# EAGLE design hacklace (EAGLE 6.5.0)
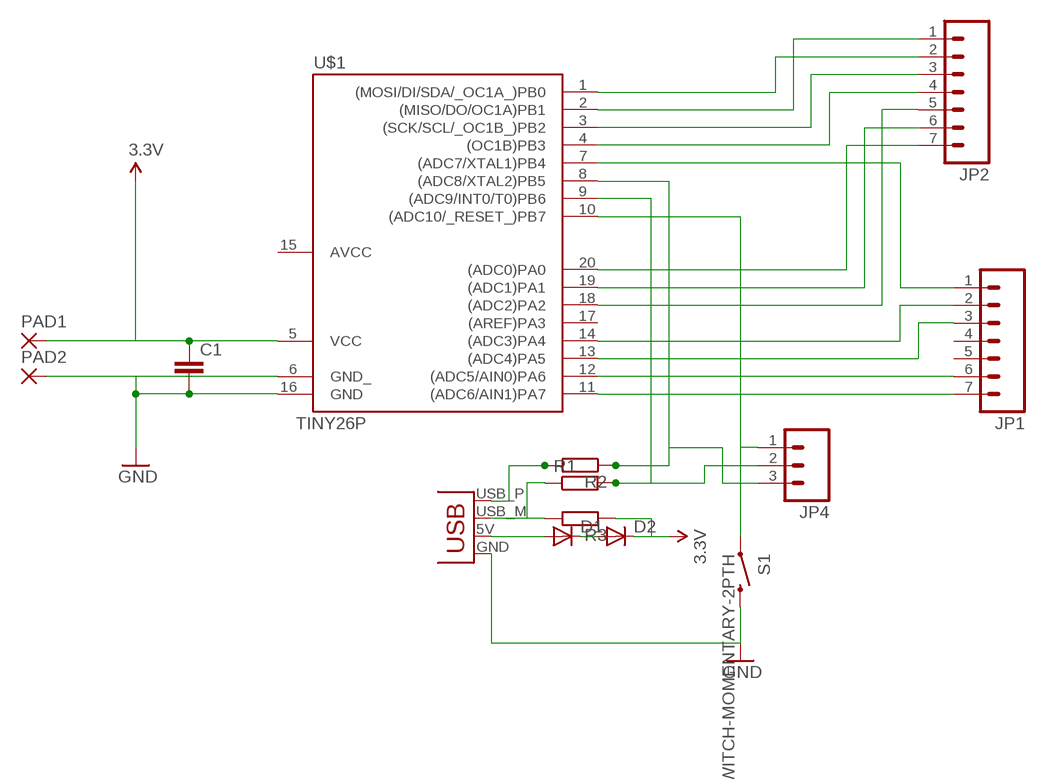
[diagram p0: schematic, sheet 1]

## Parts
C1  C-EU025-025X050  [C025-025X050]
D1  DIODE-D-5  [D-5]
D2  DIODE-D-5  [D-5]
JP1  M07  [1X07]
JP2  M07  [1X07]
JP3  USBPCB  [USB-A-PCB]
JP4  M03PTH  [1X03]
PAD1  1,6/0,8  [1,6/0,8]
PAD2  1,6/0,8  [1,6/0,8]
R1  R-EU_0204/7  [0204/7]
R2  R-EU_0204/7  [0204/7]
R3  R-EU_0204/7  [0204/7]
S1  SWITCH-MOMENTARY-2PTH  [TACTILE-PTH]
U$1  TINY26P  [DIL20]

## Nets
3.3V: C1.1 D2.C PAD1.1(P) R3.1 U$1.5(VCC)
GND: C1.2 JP3.GND PAD2.1(P) S1.3 U$1.6(GND_) U$1.16(GND)
N$1: JP3.USB_M(D-) R1.1 R3.2
N$2: JP4.1 S1.1 U$1.10((ADC10/_RESET_)PB7)
N$3: JP1.2 U$1.14((ADC3)PA4)
N$4: JP4.2 R1.2 U$1.9((ADC9/INT0/T0)PB6)
N$5: JP4.3 R2.1 U$1.8((ADC8/XTAL2)PB5)
N$6: JP2.6 U$1.19((ADC1)PA1)
N$7: JP2.2 U$1.1((MOSI/DI/SDA/_OC1A_)PB0)
N$9: D1.A JP3.5V(VBUS)
N$10: JP2.4 U$1.4((OC1B)PB3)
N$11: JP2.3 U$1.3((SCK/SCL/_OC1B_)PB2)
N$12: JP2.7 U$1.20((ADC0)PA0)
N$13: JP1.6 U$1.12((ADC5/AIN0)PA6)
N$14: JP2.5 U$1.18((ADC2)PA2)
N$15: JP2.1 U$1.2((MISO/DO/OC1A)PB1)
N$16: JP1.3 U$1.13((ADC4)PA5)
N$17: JP1.7 U$1.11((ADC6/AIN1)PA7)
N$18: JP3.USB_P(D+) R2.2
N$19: JP1.1 U$1.7((ADC7/XTAL1)PB4)
N$20: D1.C D2.A
Unconnected: JP1.4 JP1.5 U$1.17((AREF)PA3)

## Power pins joined to a net without a drawn wire
AVCC: U$1.15(AVCC)

## Library data of the parts
C1 = rcl:C-EU: CAPACITOR, European symbol
D1 D2 = diode:DIODE-: DIODE
JP1 JP2 = SparkFun-Connectors:M07: Header 7 Standard 7-pin 0.1" header. Use with straight break away headers (SKU : PRT-00116), right angle break away headers (PRT-00553), swiss pins (PRT-00743), machine pins (PRT-00117), and female headers (PRT-00115). NOTES ON THE VARIANTS LOCK and LOCK_LONGPADS... This footprint was designed to help hold the alignment of a through-hole component (i.e. 7-pin header) while soldering it into place. You may notice that each hole has been shifted either up or down by 0.005 of an inch from it's more standard position (which is usually a perfectly straight line). This slight alteration caused the pins (the squares in the middle) to touch the edges of the holes. Because they are alternating, it causes a "brace" to hold the header in place. 0.005 has proven to be the perfect amount of "off-center" position when using our standard breakaway headers. Although looks a little odd when you look at the bare footprint, once you have a header in there, the alteration is very hard to notice. Also, if you push a header all the way into place, it is covered up entirely on the bottom side. This idea of altering the position of holes to aid alignment will be further integrated into the Sparkfun Library for other footprints. It can help hold any component with 3 or more connection pins.
JP3 = SparkFun-Connectors:USB: USB Connectors USB-B-PTH is fully proven SKU : PRT-00139/CONN-08278 USB-miniB is fully proven SKU : PRT-00587 USB-A-PCB is untested. USB-A-H is throughly reviewed, but untested. Spark Fun Electronics SKU : PRT-00437 USB-B-SMT is throughly reviewed, but untested. Needs silkscreen touching up. USB-A-S has not been used/tested USB-MB-H has not been used/tested USB-MICROB has been used. CONN-09505
JP4 = SparkFun-Connectors:M03: Header 3 Standard 3-pin 0.1" header. Use with straight break away headers (SKU : PRT-00116), right angle break away headers (PRT-00553), swiss pins (PRT-00743), machine pins (PRT-00117), and female headers (PRT-00115). Molex polarized connector foot print use with SKU : PRT-08232 with associated crimp pins and housings.
PAD1 PAD2 = wirepad:1,6/0,8: THROUGH-HOLE PAD
R1-R3 = resistor:R-EU_: RESISTOR, European symbol
S1 = SparkFun-Electromechanical:SWITCH-MOMENTARY-2: Various NO switches- pushbuttons, reed, etc
U$1 = avr-5:TINY26

## Board
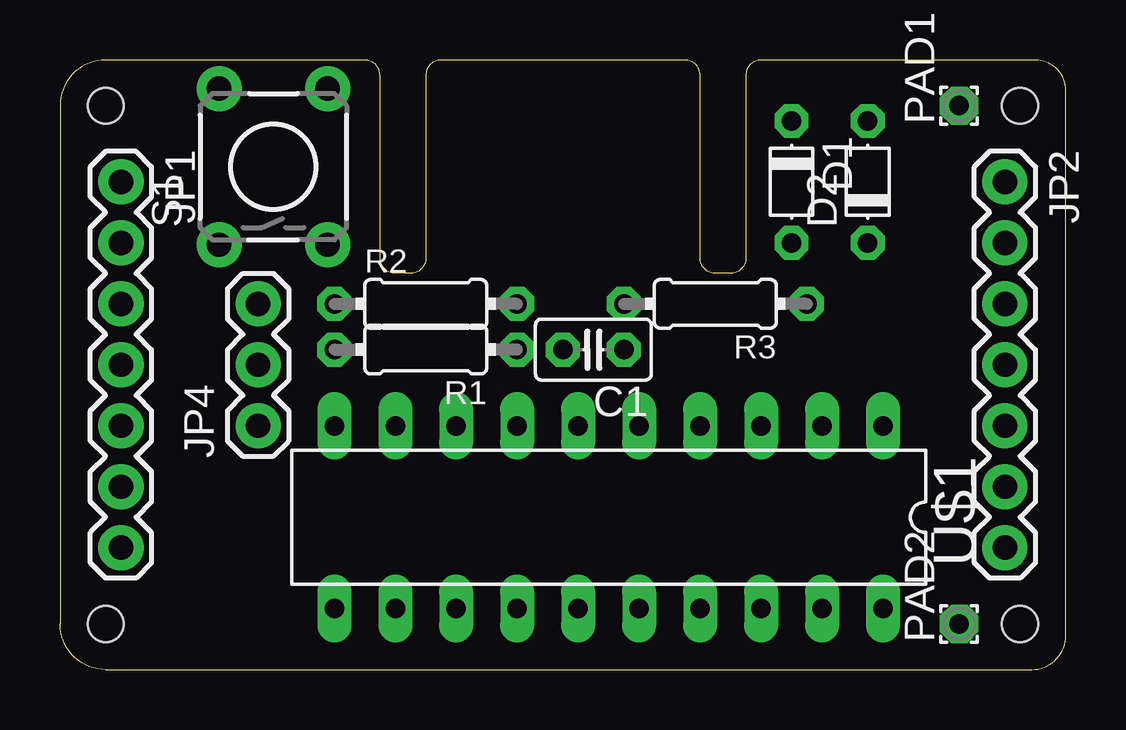
[diagram p1: board, top side]
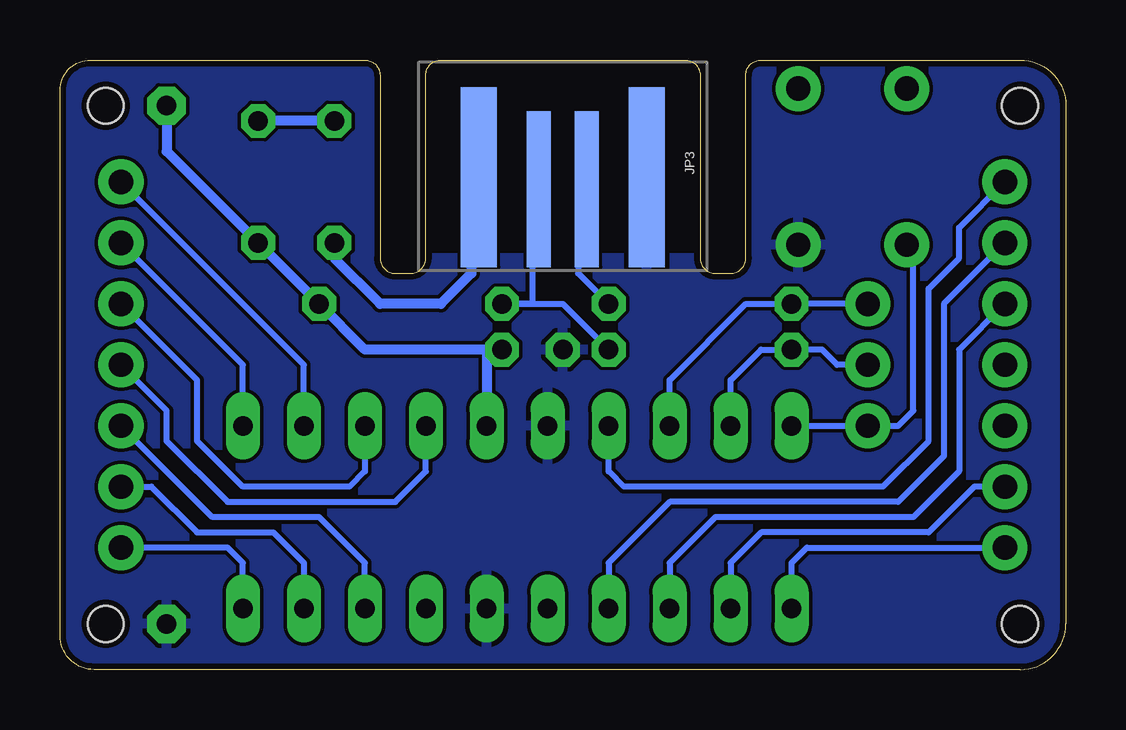
[diagram p2: board, bottom side, seen from below]

Size 41.91 x 25.4 mm. Coordinates in mm from the lower left corner, seen from the top.
Outline: 36.83,25.4 40.64,25.4 arc-90 41.91,24.13 41.91,1.42 arc-90 40.49,0 1.91,0 arc-90 0,1.91 0,23.5 arc-90 1.91,25.4 12.7,25.4 arc-90 13.34,24.77 13.34,17.14 arc90 13.97,16.51 14.61,16.51 arc90 15.24,17.14 15.24,24.77 arc-90 15.88,25.4 26.04,25.4 arc-90 26.67,24.77 26.67,17.14 arc90 27.3,16.51 27.94,16.51 arc90 28.57,17.14 28.57,24.77 arc-90 29.21,25.4 36.82,25.4
Copper layers 16: Bottom 0.035mm
Design rules "eC_1Layer_PClass6_BaseCopperO35_eCDefault": minimum track width 0.15mm, minimum drill 0.35mm, track to track 0.15mm, track to pad 0.15mm, pad to pad 0.15mm, via to via 0.15mm, smd to smd 0mil, copper to edge 0.25mm, drill to drill 0.35mm, minimum pad ring 0.3mm, minimum via ring 0.3mm, stop-mask expansion 0mil, vias tented up to drill 0.45mm, thermal gap 0.2mm
Holes 1.5 mm at 40.01,1.91 40.01,23.5 1.91,1.91 1.91,23.5

### Footprints (pad centres in the part's own frame; a part is rotated, then mirrored left to right if it is on the bottom)
C025-025X050 = drill 0.813 octagon: 1 -1.27,0; 2 1.27,0
D-5 = drill 0.813 octagon: A 2.54,0; C -2.54,0
1X07 = drill 1.016 pad 1.88: 1 0,0; 2 2.54,0; 3 5.08,0; 4 7.62,0; 5 10.16,0; 6 12.7,0; 7 15.24,0
USB-A-PCB = smd 7.5 x 1.5: 5V -0.2,-3.5; GND -0.2,3.5 | smd 6.5 x 1: USB_M 0.3,-1; USB_P 0.3,1
1X03 = drill 1.016 pad 1.88: 1 0,0; 2 2.54,0; 3 5.08,0
1,6/0,8 = drill 0.813 pad 1.6 octagon: 1 0,0
0204/7 = drill 0.813 octagon: 1 -3.81,0; 2 3.81,0
TACTILE-PTH = drill 1.016 pad 1.88: 1 -3.251,2.261; 2 3.251,2.261; 3 -3.251,-2.261; 4 3.251,-2.261
DIL20 = drill 0.813 long: 1 -11.43,-3.81; 2 -8.89,-3.81; 3 -6.35,-3.81; 4 -3.81,-3.81; 5 -1.27,-3.81; 6 1.27,-3.81; 7 3.81,-3.81; 8 6.35,-3.81; 9 8.89,-3.81; 10 11.43,-3.81; 11 11.43,3.81; 12 8.89,3.81; 13 6.35,3.81; 14 3.81,3.81; 15 1.27,3.81; 16 -1.27,3.81; 17 -3.81,3.81; 18 -6.35,3.81; 19 -8.89,3.81; 20 -11.43,3.81

### Placement (x,y rotation side)
C1  22.23,13.34 180 top
D1  30.48,20.32 270 top
D2  33.66,20.32 90 top
JP1  2.54,20.32 270 top
JP2  39.37,20.32 270 top
JP3  20.95,20.32 270 bottom
JP4  8.26,10.16 90 top
PAD1  37.47,23.5 90 top
PAD2  37.47,1.91 90 top
R1  15.24,13.34 180 top
R2  15.24,15.24 0 top
R3  27.3,15.24 180 top
S1  8.89,20.95 90 top
U$1  22.86,6.35 180 top

### Tracks (layer width: path | path; a pad name or v marks a point on that pad's centre or on a via)
3.3V
  Bottom 0.406: 24.13,13.34 U$1.5 | PAD1.1 37.47,21.59 D2.C R3.1 29.21,13.34 24.13,13.34 | C1.1 24.13,13.34
GND
  pour Bottom: -0.64,-1.27 -0.64,26.04 13.34,26.04 13.34,17.14 28.57,17.14 28.57,26.04 42.55,26.04 42.55,-1.27
N$1
  Bottom 0.254: JP3.USB_M 21.59,19.05 22.23,20.32 21.59,20.32 22.23,19.68 22.23,15.24 R3.2 20.95,15.24 R1.1
N$2
  Bottom 0.254: U$1.10 JP4.1 6.99,10.16 6.35,10.79 6.35,17.14 S1.1
N$3
  Bottom 0.254: JP1.2 5.08,15.24 5.08,8.89 6.99,6.99 16.51,6.99 19.05,4.45 U$1.14
N$4
  Bottom 0.254: U$1.9 13.97,12.06 12.7,13.34 R1.2 10.16,13.34 9.53,12.7 JP4.2
N$5
  Bottom 0.254: U$1.8 16.51,12.06 13.34,15.24 R2.1 JP4.3
N$6
  Bottom 0.254: JP2.6 38.1,7.62 36.2,5.71 33.02,5.71 31.75,4.45 U$1.19
N$7
  Bottom 0.254: U$1.1 34.29,12.7 JP2.2
N$9
  Bottom 0.254: 24.77,20.32 JP3.5V
  Bottom 0.406: 24.77,20.95 24.77,20.32 24.77,16.51 26.04,15.24 28.57,15.24 30.48,17.14 D1.A
N$10
  Bottom 0.254: JP2.4 37.47,10.79 37.47,9.53 34.92,6.99 27.94,6.99 26.67,8.26 U$1.4
N$11
  Bottom 0.254: U$1.3 29.21,8.26 29.84,7.62 34.29,7.62 36.2,9.53 36.2,12.06 JP2.3
N$12
  Bottom 0.254: U$1.20 34.29,4.45 34.92,5.08 JP2.7
N$13
  Bottom 0.254: JP1.6 3.81,7.62 5.71,5.71 12.7,5.71 13.97,4.45 U$1.12
N$14
  Bottom 0.254: U$1.18 29.21,4.45 31.11,6.35 35.56,6.35 JP2.5
N$15
  Bottom 0.254: U$1.2 31.75,12.7 JP2.1
N$16
  Bottom 0.254: JP1.3 4.45,13.34 4.45,8.26 6.35,6.35 14.61,6.35 16.51,4.45 U$1.13
N$17
  Bottom 0.254: U$1.11 11.43,4.45 10.79,5.08 JP1.7
N$18
  Bottom 0.254: R2.2 20.32,16.51 20.32,19.68 19.68,19.68 JP3.USB_P
  Bottom 0.406: 19.68,20.32 19.68,19.68
N$19
  Bottom 0.254: U$1.7 19.05,8.26 18.41,7.62 7.62,7.62 5.71,9.53 5.71,15.88 4.45,17.14 4.45,18.41 JP1.1
N$20
  Bottom 0.406: D1.C D2.A